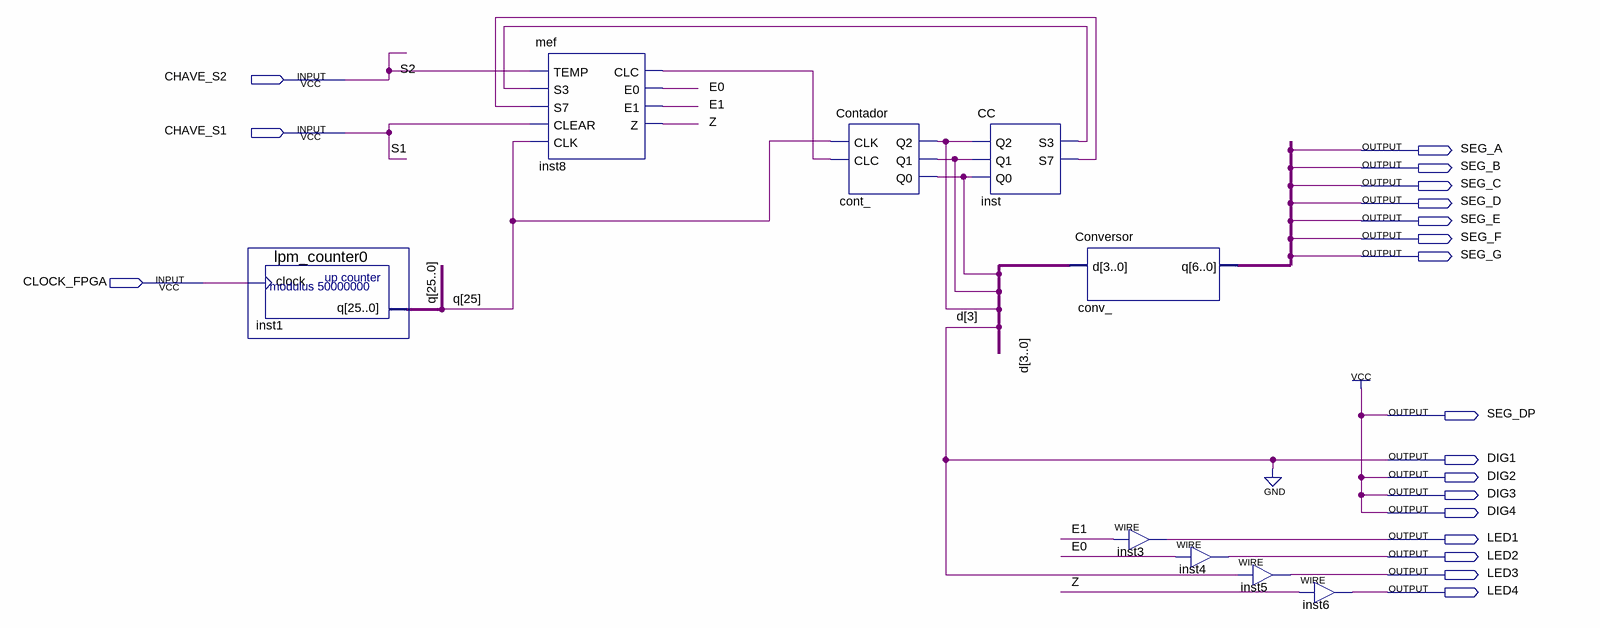
[diagram p0: schematic sheet]
// Quartus schematic Final.bdf as structural Verilog: 9 symbols, 19 pins
module Final (
  input  CHAVE_S2,
  input  CHAVE_S1,
  input  CLOCK_FPGA,
  output SEG_A,
  output SEG_B,
  output SEG_C,
  output SEG_D,
  output SEG_E,
  output SEG_F,
  output SEG_G,
  output SEG_DP,
  output DIG1,
  output DIG2,
  output DIG3,
  output DIG4,
  output LED1,
  output LED2,
  output LED3,
  output LED4
);

  wire E0, E1, inst8_clc, inst_s3, inst_s7, Z;
  wire [2:0] d;
  wire [6:0] conv__q;
  wire [25:0] q;

  lpm_counter0 inst1 (.clock(CLOCK_FPGA), .q(q));
  mef inst8 (
    .TEMP(CHAVE_S2), .S3(inst_s3), .S7(inst_s7), .CLEAR(CHAVE_S1), .CLK(q[25]), .CLC(inst8_clc), .E0(E0),
    .E1(E1), .Z(Z));
  Contador cont_ (.CLK(q[25]), .CLC(inst8_clc), .Q2(d[2]), .Q1(d[1]), .Q0(d[0]));
  CC inst (.Q2(d[2]), .Q1(d[1]), .Q0(d[0]), .S3(inst_s3), .S7(inst_s7));
  Conversor conv_ (.d({1'b0, d}), .q(conv__q));
  assign LED1 = E1;  // WIRE inst3
  assign LED2 = E0;  // WIRE inst4
  assign LED3 = 1'b0;  // WIRE inst5
  assign LED4 = Z;  // WIRE inst6

  assign DIG1 = 1'b0;
  assign DIG2 = 1'b1;
  assign DIG3 = 1'b1;
  assign DIG4 = 1'b1;
  assign SEG_DP = 1'b1;

  // Other names for the same wires on the sheet: S1 = CHAVE_S1; S2 = CHAVE_S2
endmodule
